# EAGLE design deadlocks3 (EAGLE 8.7.1)
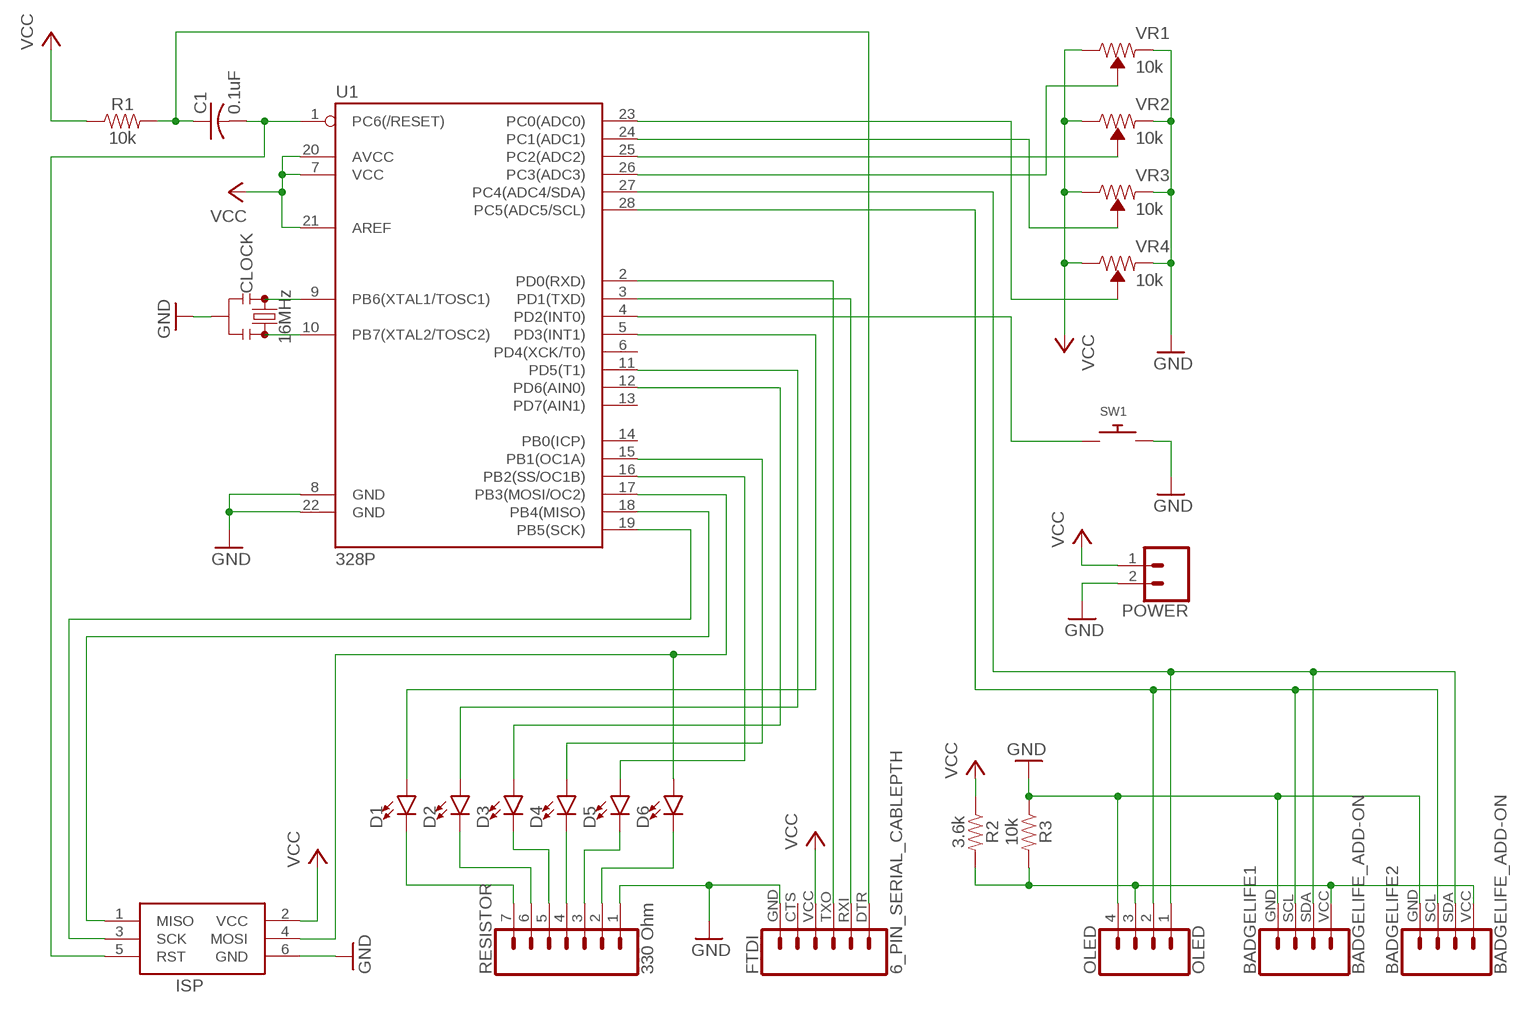
[diagram p0: schematic, sheet 1]

## Parts
BADGELIFE1  BADGELIFE_ADD-ON  [BADGELIFE_ADD-ON]
BADGELIFE2  BADGELIFE_ADD-ON  [BADGELIFE_ADD-ON]
C1  0.1uF  C-US025-024X044  [C025-024X044]
CLOCK  16MHz  RESONATORPTH-7.6X3.8  [RESONATOR-PTH-7.6X3.8]
D1  LED5MM  [LED_5MM]
D2  LED5MM  [LED_5MM]
D3  LED5MM  [LED_5MM]
D4  LED5MM  [LED_5MM]
D5  LED5MM  [LED_5MM]
D6  LED5MM  [LED_5MM]
FTDI  6_PIN_SERIAL_CABLEPTH  [FTDI_BASIC]
ISP  AVRISP-6  [AVRISP]
OLED  OLED  CONN_04  [1X04]
POWER  CONN_02  [1X02]
R1  10k  10KOHM-HORIZ-1/4W-1%  [AXIAL-0.3]
R2  3.6k  10KOHM-HORIZ-1/4W-1%  [AXIAL-0.3]
R3  10k  10KOHM-HORIZ-1/4W-1%  [AXIAL-0.3]
RESISTOR  330 Ohm  CONN_07  [1X07]
SW1  SWITCH_PUSHBUTTONEVQ-PE  [TACT_PANA-EVQ]
U1  328P  ATMEGA328P_PDIP  [DIP28]
VR1  10k  TRIMPOT-PTH-10MM-KNOB-1/2W-10%  [TRIMPOT-PTH-3386U]
VR2  10k  TRIMPOT-PTH-10MM-KNOB-1/2W-10%  [TRIMPOT-PTH-3386U]
VR3  10k  TRIMPOT-PTH-10MM-KNOB-1/2W-10%  [TRIMPOT-PTH-3386U]
VR4  10k  TRIMPOT-PTH-10MM-KNOB-1/2W-10%  [TRIMPOT-PTH-3386U]

## Nets
GND: BADGELIFE1.GND BADGELIFE2.GND CLOCK.2 FTDI.GND ISP.6(GND) OLED.4 POWER.2 R3.P$1 RESISTOR.1 SW1.P$2 U1.8(GND) U1.22(GND) VR1.1(CCW) VR2.1(CCW) VR3.1(CCW) VR4.1(CCW)
N$1: U1.26(PC3(ADC3)) VR1.2(WIPER)
N$2: CLOCK.1 U1.9(PB6(XTAL1/TOSC1))
N$3: CLOCK.3 U1.10(PB7(XTAL2/TOSC2))
N$4: U1.25(PC2(ADC2)) VR2.2(WIPER)
N$5: U1.24(PC1(ADC1)) VR3.2(WIPER)
N$6: U1.23(PC0(ADC0)) VR4.2(WIPER)
N$7: FTDI.RXI U1.3(PD1(TXD))
N$8: FTDI.TXO U1.2(PD0(RXD))
N$9: ISP.1(MISO) U1.18(PB4(MISO))
N$10: BADGELIFE1.VCC BADGELIFE2.VCC OLED.3 R2.P$2 R3.P$2
N$11: C1.2 ISP.5(RST) U1.1(PC6(/RESET))
N$12: D6.K(C) RESISTOR.2
N$13: D5.K(C) RESISTOR.3
N$14: D4.K(C) RESISTOR.4
N$15: D3.K(C) RESISTOR.5
N$16: D2.K(C) RESISTOR.6
N$17: D1.K(C) RESISTOR.7
N$18: D6.A ISP.4(MOSI) U1.17(PB3(MOSI/OC2))
N$19: D1.A U1.5(PD3(INT1))
N$20: D2.A U1.11(PD5(T1))
N$21: D3.A U1.12(PD6(AIN0))
N$22: D4.A U1.15(PB1(OC1A))
N$23: D5.A U1.16(PB2(SS/OC1B))
N$24: ISP.3(SCK) U1.19(PB5(SCK))
N$25: SW1.P$1 U1.4(PD2(INT0))
N$26: BADGELIFE1.SDA BADGELIFE2.SDA OLED.1 U1.27(PC4(ADC4/SDA))
N$27: C1.1 FTDI.DTR R1.P$2
N$28: BADGELIFE1.SCL BADGELIFE2.SCL OLED.2 U1.28(PC5(ADC5/SCL))
VCC: FTDI.VCC ISP.2(VCC) POWER.1 R1.P$1 R2.P$1 U1.7(VCC) U1.20(AVCC) U1.21(AREF) VR1.3(CW) VR2.3(CW) VR3.3(CW) VR4.3(CW)
Unconnected: FTDI.CTS U1.6(PD4(XCK/T0)) U1.13(PD7(AIN1)) U1.14(PB0(ICP))

## Library data of the parts
BADGELIFE1 BADGELIFE2 = Badgelife:BADGELIFE_ADD-ON
C1 = adafruit:C-US: CAPACITOR, American symbol
CLOCK = SparkFun-Clocks:RESONATOR: Resonators (Generic) Ceramic resonators are clock-generating components, often used to control timing in microcontrollers. They usually have 3 pins: two pins for oscillation, and one pin for ground. Compared to crystals, resonators have worse tolerance, but are usually much cheaper. Plus, they have built-in load capacitors! These devices are used on boards like the Arduino Pro 8MHz <https://www.sparkfun.com/products/11114> and Arduino Pro 16MHz <https://www.sparkfun.com/products/11113>.
D1-D6 = SparkFun-LED:LED: LED (Generic) Standard schematic elements and footprints for 5mm, 3mm, 1206, and 0603 sized LEDs. Generic LEDs with no color specified.
FTDI = SparkFun-Connectors:6_PIN_SERIAL_CABLE: 6-pin header connection for use with the "FTDI BASIC" pinout - CABLE SIDE. Also known as "Arduino Serial Program Header". This is used on a design to provide a 6-pin connection point for serial communication usually from a USB cable (D+/D-) to these headers (RX/TX). It also has the remaining pins necessary for programming in the Arduino evironment (DTR, GND, and sometimes VCC). Note, this device has "CABLE" in the name. It is intended to be used on a design that usually lives on the end of your USB cable and prvides the converter chip (FTDI232 or FTDI231x) to commnicate serial RX/TX. The "sister" device, named "TARGET" is inteneded to be used on a design that contains a target micro-controller that you wish to program. You can populate with some of these: Female Headers <https://www.sparkfun.com/products/115> (PRT-00115) For reference (or to suit your programming needs) check out these designs: SparkFun FTDI Basic Breakout - 5V <https://www.sparkfun.com/products/9716> (DEV-09716) SparkFun FTDI Basic Breakout - 3.3V <https://www.sparkfun.com/products/9873> (DEV-09873) SparkFun FTDI SmartBasic <https://www.sparkfun.com/products/12935> (DEV-12935) SparkFun Beefy 3 - FTDI Basic Breakout <https://www.sparkfun.com/products/13746> (DEV-13746)
ISP = adafruit:AVRISP: AVR ISP HEADER Standard 6 pin header for AVR programming
OLED = SparkFun-Connectors:CONN_04: Multi connection point. Often used as Generic Header-pin footprint for 0.1 inch spaced/style header connections On any of the 0.1 inch spaced packages, you can populate with these: Break Away Headers - Straight <https://www.sparkfun.com/products/116> (PRT-00116) Break Away Male Headers - Right Angle <https://www.sparkfun.com/products/553> (PRT-00553) Female Headers <https://www.sparkfun.com/products/115> (PRT-00115) Break Away Headers - Machine Pin <https://www.sparkfun.com/products/117> (PRT-00117) Break Away Female Headers - Swiss Machine Pin <https://www.sparkfun.com/products/743> (PRT-00743) For SCREWTERMINALS and SPRING TERMINALS visit here: Screw Terimnals on SparkFun.com <https://www.sparkfun.com/search/results?term=Screw+Terminals> (5mm/3.5mm/2.54mm spacing) This device is also useful as a general connection point to wire up your design to another part of your project. Our various solder wires solder well into these plated through hole pads. Hook-Up Wire - Assortment (Stranded, 22 AWG) <https://www.sparkfun.com/products/11375> (PRT-11375) Hook-Up Wire - Assortment (Solid Core, 22 AWG) <https://www.sparkfun.com/products/11367> (PRT-11367) View the entire wire category on our website here <https://www.sparkfun.com/categories/141> Special notes: Molex polarized connector foot print use with SKU : PRT-08231 with associated crimp pins and housings. 1MM SMD Version SKU: PRT-10208; PROD_ID: CONN-09696
POWER = SparkFun-Connectors:CONN_02: Multi connection point. Often used as Generic Header-pin footprint for 0.1 inch spaced/style header connections On any of the 0.1 inch spaced packages, you can populate with these: Break Away Headers - Straight <https://www.sparkfun.com/products/116> (PRT-00116) Break Away Male Headers - Right Angle <https://www.sparkfun.com/products/553> (PRT-00553) Female Headers <https://www.sparkfun.com/products/115> (PRT-00115) Break Away Headers - Machine Pin <https://www.sparkfun.com/products/117> (PRT-00117) Break Away Female Headers - Swiss Machine Pin <https://www.sparkfun.com/products/743> (PRT-00743) For SCREWTERMINALS and SPRING TERMINALS visit here: Screw Terimnals on SparkFun.com <https://www.sparkfun.com/search/results?term=Screw+Terminals> (5mm/3.5mm/2.54mm spacing) This device is also useful as a general connection point to wire up your design to another part of your project. Our various solder wires solder well into these plated through hole pads. Hook-Up Wire - Assortment (Stranded, 22 AWG) <https://www.sparkfun.com/products/11375> (PRT-11375) Hook-Up Wire - Assortment (Solid Core, 22 AWG) <https://www.sparkfun.com/products/11367> (PRT-11367) View the entire wire category on our website here <https://www.sparkfun.com/categories/141> Special notes: Molex polarized connector foot print use with: PRT-08233 with associated crimp pins and housings. 2.54_SCREWTERM for use with PRT-10571. 3.5mm Screw Terminal footprints for PRT-08084 5mm Screw Terminal footprints for use with PRT-08432
R1 R3 = SparkFun-Resistors:10KOHM: 10kΩ resistor A resistor is a passive two-terminal electrical component that implements electrical resistance as a circuit element. Resistors act to reduce current flow, and, at the same time, act to lower voltage levels within circuits. - Wikipedia; PROD_ID: RES-12183
R2 = SparkFun-Resistors:10KOHM: 10kΩ resistor A resistor is a passive two-terminal electrical component that implements electrical resistance as a circuit element. Resistors act to reduce current flow, and, at the same time, act to lower voltage levels within circuits. - Wikipedia; PROD_ID: RES-12183; VALUE: 10k
RESISTOR = SparkFun-Connectors:CONN_07: Multi connection point. Often used as Generic Header-pin footprint for 0.1 inch spaced/style header connections On any of the 0.1 inch spaced packages, you can populate with these: Break Away Headers - Straight <https://www.sparkfun.com/products/116> (PRT-00116) Break Away Male Headers - Right Angle <https://www.sparkfun.com/products/553> (PRT-00553) Female Headers <https://www.sparkfun.com/products/115> (PRT-00115) Break Away Headers - Machine Pin <https://www.sparkfun.com/products/117> (PRT-00117) Break Away Female Headers - Swiss Machine Pin <https://www.sparkfun.com/products/743> (PRT-00743) For SCREWTERMINALS and SPRING TERMINALS visit here: Screw Terimnals on SparkFun.com <https://www.sparkfun.com/search/results?term=Screw+Terminals> (5mm/3.5mm/2.54mm spacing) This device is also useful as a general connection point to wire up your design to another part of your project. Our various solder wires solder well into these plated through hole pads. Hook-Up Wire - Assortment (Stranded, 22 AWG) <https://www.sparkfun.com/products/11375> (PRT-11375) Hook-Up Wire - Assortment (Solid Core, 22 AWG) <https://www.sparkfun.com/products/11367> (PRT-11367) View the entire wire category on our website here <https://www.sparkfun.com/categories/141> Special notes: Molex polarized connector foot print use with SKU : PRT-08231 with associated crimp pins and housings. 1MM SMD Version SKU: PRT-10208 NOTES ON THE VARIANTS LOCK and LOCK_LONGPADS... This footprint was designed to help hold the alignment of a through-hole component (i.e. 6-pin header) while soldering it into place. You may notice that each hole has been shifted either up or down by 0.005 of an inch from it's more standard position (which is a perfectly straight line). This slight alteration caused the pins (the squares in the middle) to touch the edges of the holes. Because they are alternating, it causes a "brace" to hold the component in place. 0.005 has proven to be the perfect amount of "off-center" position when using our standard breakaway headers. Although looks a little odd when you look at the bare footprint, once you have a header in there, the alteration is very hard to notice. Also,if you push a header all the way into place, it is covered up entirely on the bottom side.
SW1 = adafruit:SWITCH_PUSHBUTTON: Buttons SOFTTOUCHSMD_SJ - Soft touch temporary push button (Super Junk Akihabara) Compatible with SKPMANE010 [Mouser: 688-SKPMAN] C&K_KSS = Digikey: KSS221GLFS
U1 = SparkFun-IC-Microcontroller:ATMEGA328P_PDIP: Atmel 328P Through hole ATMEGA328P uC used in the Arduino 32kb flash, 1k EEPROM, 2k SRAM Datasheet <http://www.sparkfun.com/datasheets/Components/SMD/ATMega328.pdf> SparkFun Products Storefront component: AVR 28 Pin 20MHz 32K 6A/D - ATMega328P <https://www.sparkfun.com/products/9061> (COM-09061) SparkFun Simon Says - Through-Hole Soldering Kit <https://www.sparkfun.com/products/10547> (KIT-10547) SparkFun Learn to Solder - Simon Says <https://www.sparkfun.com/products/13708> (KIT-13708) SparkFun BigTime Watch Kit <https://www.sparkfun.com/products/11734> (KIT-11734) SparkFun ClockIt <https://www.sparkfun.com/products/10930> (KIT-10930) SparkFun Serial Enabled LCD Kit <https://www.sparkfun.com/products/10097> (LCD-10097) SparkFun Simon Tilts - Through Hole Soldering Kit <https://www.sparkfun.com/products/12634> (KIT-12634) SparkFun Frequency Counter Kit <https://www.sparkfun.com/products/10140> (KIT-10140) FabFM Radio Kit <https://www.sparkfun.com/products/11043> (KIT-11043) SparkFun Binary Blaster Kit <https://www.sparkfun.com/products/12037> (KIT-12037) SparkFun Metro-Gnome <https://www.sparkfun.com/products/9236> (KIT-09236) ATmega328 with Arduino Optiboot (Uno) <https://www.sparkfun.com/products/10524> (DEV-10524); PROD_ID: IC-09136
VR1-VR4 = SparkFun-Resistors:TRIMPOT: Trimming Potentiometer (Trimpot) Three-terminal potentiometers, with an adjustable wiper and two adjustable resistors. A pot can be used to create a configurable voltage divider, or as a variable resistor. "Trimpots" are a subset of potentiometers, usually intended for "set-and-forget" applications. They're often more delicate than standard potentiometers - rated for fewer turns. Variants PTH-KNOB - PTH Trimpot w/ finger-adjustable knob Trimpot 10K with Knob <https://www.sparkfun.com/products/9806> (COM-09806) Datasheet <http://www.sparkfun.com/datasheets/Components/General/TSR-3386.pdf> SMD-3MM-CLOSED-FRAME - SMD 3mm Square Closed-Frame Trimpot Used on e.g. EasyDriver - Stepper Motor Driver <https://www.sparkfun.com/products/12779> Datasheet <http://www.bitechnologies.com/pdfs/22.pdf> (22AR10KTR) SMD-5MM - SMD 5mm Square Closed-Frame Trimpot Used on e.g. IOIO-OTG - V2.2 <https://www.sparkfun.com/products/13613> Datasheet <http://www.vishay.com/docs/51008/ts53.pdf> (TS53YL502MR10) SMD-3MM-1/10W-25% - 3mm Square Open-Frame Trimpot Used on e.g. SparkFun Shapeoko <https://www.sparkfun.com/products/13899> Datasheet <http://www.bourns.com/docs/Product-Datasheets/TC33.pdf> (TC33X-2-103E); PROD_ID: RES-09730; SF_SKU: COM-09806

## Net classes
0 default: width 0.127 mm, clearance 0.254 mm

## Board
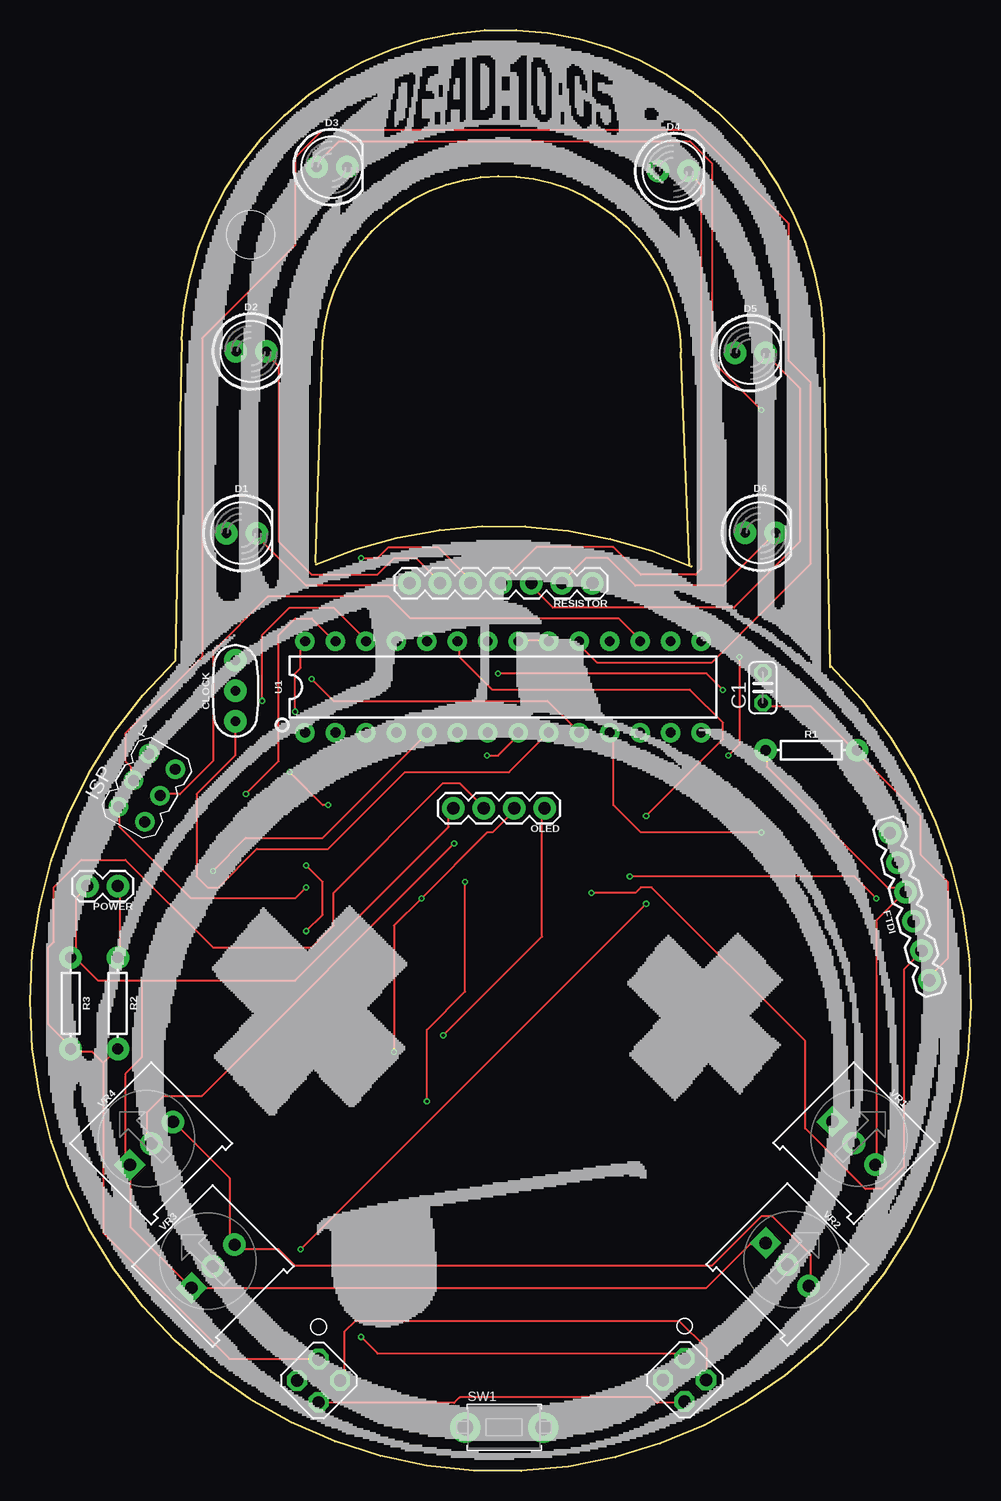
[diagram p1: board, top side]
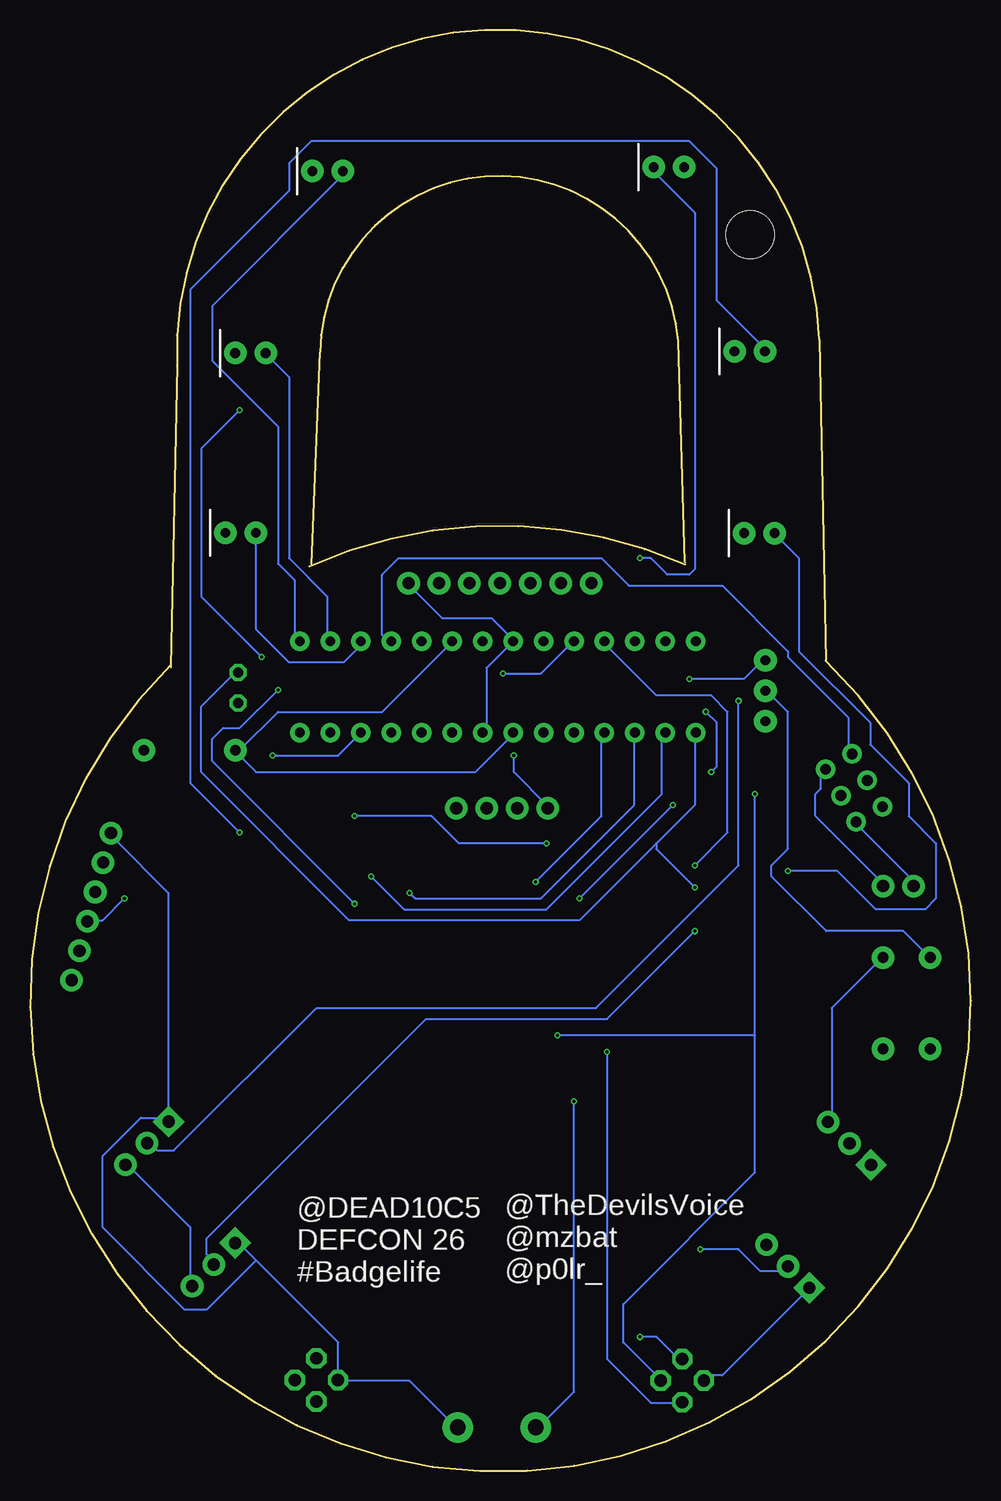
[diagram p2: board, bottom side, seen from below]

Size 78.45 x 120.12 mm. Coordinates in mm from the lower left corner, seen from the top.
Outline: 23.83,75.58 arc-47 55.16,75.41
Outline: 23.83,75.76 24.36,92.73 arc-180 54.28,93.26 54.98,75.58
Outline: 66.18,92.03 arc181 12.63,94.31 12.11,67.53 arc272 66.71,67.18
Outline: 66.18,92.21 66.71,67.01
Copper layers (1*16): Top 0.035559375mm / dielectric 1.6mm / Bottom 0.035559375mm
Design rules "oshpark-2layer": minimum track width 6mil, minimum drill 10mil, track to track 6mil, track to pad 6mil, pad to pad 6mil, via to via 6mil, smd to smd 6mil, copper to edge 15mil, drill to drill 6mil, minimum pad ring 5mil, minimum via ring 5mil, stop-mask expansion 2.5mil, vias tented up to drill 0mil, thermal gap 10mil
Holes 4 mm at 18.41,103.06

### Footprints (pad centres in the part's own frame; a part is rotated, then mirrored left to right if it is on the bottom)
BADGELIFE_ADD-ON = drill 1.016 pad 1.676 octagon: GND 1.27,-1.27; SCL 1.27,1.27; SDA -1.27,1.27; VCC -1.27,-1.27
C025-024X044 = drill 0.813 pad 1.422 octagon: 1 -1.27,0; 2 1.27,0
RESONATOR-PTH-7.6X3.8 = drill 0.8 pad 1.88: 1 -2.54,0; 2 0,0; 3 2.54,0
LED_5MM = drill 0.813 pad 1.88: A -1.27,0; K 1.27,0
FTDI_BASIC = drill 1.016 pad 1.88: CTS 10.16,0; DTR 0,0; GND 12.7,0; RXI 2.54,0; TXO 5.08,0; VCC 7.62,0
AVRISP = drill 0.9 pad 1.626: 1 -1.27,2.54; 2 1.27,2.54; 3 -1.27,0; 4 1.27,0; 5 -1.27,-2.54; 6 1.27,-2.54
1X04 = drill 1.016 pad 1.88: 1 0,0; 2 2.54,0; 3 5.08,0; 4 7.62,0
1X02 = drill 1.016 pad 1.88: 1 0,0; 2 2.54,0
AXIAL-0.3 = drill 0.9 pad 1.88: P$1 -3.81,0; P$2 3.81,0
1X07 = drill 1.016 pad 1.88: 1 0,0; 2 2.54,0; 3 5.08,0; 4 7.62,0; 5 10.16,0; 6 12.7,0; 7 15.24,0
TACT_PANA-EVQ = drill 1.3 pad 2.54: P$1 -3.25,0; P$2 3.25,0
DIP28 = drill 0.813 pad 1.626: 1 -16.51,-3.81; 2 -13.97,-3.81; 3 -11.43,-3.81; 4 -8.89,-3.81; 5 -6.35,-3.81; 6 -3.81,-3.81; 7 -1.27,-3.81; 8 1.27,-3.81; 9 3.81,-3.81; 10 6.35,-3.81; 11 8.89,-3.81; 12 11.43,-3.81; 13 13.97,-3.81; 14 16.51,-3.81; 15 16.51,3.81; 16 13.97,3.81; 17 11.43,3.81; 18 8.89,3.81; 19 6.35,3.81; 20 3.81,3.81; 21 1.27,3.81; 22 -1.27,3.81; 23 -3.81,3.81; 24 -6.35,3.81; 25 -8.89,3.81; 26 -11.43,3.81; 27 -13.97,3.81; 28 -16.51,3.81
TRIMPOT-PTH-3386U = drill 1.016 pad 1.88 square: 1 -2.54,-0.015 | drill 1.016 pad 1.88: 2 0,-0.015; 3 2.54,-0.015

### Placement (x,y rotation side)
BADGELIFE1  54.58,7.59 225 top
BADGELIFE2  24.07,7.54 225 top
C1  61.1,65.3 90 top
CLOCK  17.14,65.03 90 top
D1  17.64,78.18 0 top
D2  18.45,93.33 0 top
D3  25.17,108.69 0 top
D4  53.65,108.36 0 top
D5  60.07,93.2 0 top
D6  60.9,78.21 0 top
FTDI  74.98,40.91 105 top
ISP  9.74,56.94 330 top
OLED  42.91,55.25 180 top
POWER  7.32,48.76 180 top
R1  65.14,60.09 0 top
R2  7.32,39 270 top
R3  3.39,39 270 top
RESISTOR  46.89,74.01 180 top
SW1  39.53,3.64 0 top
U1  39.45,65.36 0 top
VR1  68.7,27.34 315 top
VR2  63.14,17.22 315 top
VR3  15.25,17.07 45 top
VR4  10.11,27.32 45 top

### Tracks (layer width: path | path; a pad name or v marks a point on that pad's centre or on a via)
GND  (via drill 0.25)
  Top 0.152: POWER.2 4.74,48.66 3.83,47.74 3.83,43.17 R3.P$1 3.83,42.72 5.65,40.89 9.31,40.89 | 9.31,40.89 22.11,40.89 34.92,53.69 34.92,55.06 OLED.4 | v38.12,59.63 39.03,59.63 40.4,61 40.4,61.46 U1.8 | 9.31,40.89 9.31,34.49 7.94,33.11 7.94,25.8 VR4.1 8.4,25.34 8.4,20.31 13.43,15.28 VR3.1 13.88,15.28 56.4,15.28 60.06,18.94 60.98,18.94 VR2.1
  Bottom 0.152: 66.92,29.46 66.92,48.2 71.49,52.77 FTDI.GND | SW1.P$2 43.14,3.85 46.8,7.51 52.75,7.51 BADGELIFE1.GND 52.75,7.97 52.75,10.71 59.6,17.57 | 59.6,17.57 60.98,18.94 VR2.1 | 66.92,29.46 69.21,29.46 72.41,26.26 72.41,20.31 65.55,13.45 63.72,13.45 59.6,17.57 | 66.92,29.46 VR1.1 | BADGELIFE2.GND 22.11,7.97 20.74,7.97 13.88,14.83 VR3.1 | U1.8 40.4,61.92 40.4,66.95 38.57,68.78 U1.22 38.12,69.23 39.94,71.06 44.06,71.06 46.8,73.81 RESISTOR.1 | ISP.6 9.31,53.69 4.74,49.12 POWER.2 | CLOCK.2 17.08,64.66 16.63,64.66 15.26,63.29 15.26,51.86 16.63,50.49 16.63,49.57 12.06,45 5.65,45 3.83,43.17 R3.P$1 | v38.12,59.63 38.12,58.26 35.37,55.52 OLED.4
N$1  (via drill 0.25)
  Top 0.152: v19.37,64.2 19.37,69.69 21.66,71.98 25.31,71.98 27.6,69.69 27.6,69.23 U1.26
  Bottom 0.152: v19.37,64.2 19.37,50.49 31.26,38.6 54.57,38.6 66.46,26.71 67.83,26.71 68.29,27.17 VR1.2
N$2
  Top 0.152: U1.9 43.14,61.46 39.94,58.26 31.26,58.26 24.86,51.86 18.91,51.86 15.71,48.66 14.8,48.66 13.88,49.57 13.88,56.43 17.08,59.63 17.08,62.38 CLOCK.1
N$3  (via drill 0.25)
  Top 0.152: v23.49,66.03 25.31,64.2 43.14,64.2 45.43,61.92 U1.10
  Bottom 0.152: v23.49,66.03 18.91,66.03 17.54,67.4 CLOCK.3
N$4  (via drill 0.25)
  Top 0.152: v23.03,50.49 24.4,49.12 24.4,46.37 v23.03,45
  Bottom 0.152: v23.03,50.49 20.28,53.23 20.28,63.29 21.66,64.66 26.23,64.66 30.34,68.78 U1.25 | v23.03,45 30.34,37.69 45.43,37.69 63.72,19.4 63.72,18.03 63.26,17.57 VR2.2
N$5  (via drill 0.25)
  Top 0.152: v39.03,66.49 56.4,66.49 v57.78,65.12 | v22.57,18.48 v51.37,47.29
  Bottom 0.152: v39.03,66.49 35.83,66.49 33.54,68.78 U1.24 | v57.78,65.12 60.98,61.92 62.35,61.92 63.26,61 63.26,59.17 v51.37,47.29 | v22.57,18.48 19.37,18.48 17.54,16.66 15.71,16.66 VR3.2
N$6  (via drill 0.25)
  Top 0.152: v51.37,54.6 57.78,61 57.78,62.38 55.03,65.12 38.57,65.12 35.83,67.86 35.83,68.78 U1.23 | v35.37,52.32 14.34,31.29 11.14,31.29 9.77,29.91 9.77,27.63 VR4.2
  Bottom 0.152: v51.37,54.6 44.97,54.6 42.69,52.32 v35.37,52.32
N$7  (via drill 0.25)
  Top 0.152: v46.8,48.2 50.46,48.2 50.92,48.66 51.83,48.66 64.63,35.86 64.63,28.54 69.66,23.51 71.03,23.51 72.86,25.34 72.86,41.8 74.23,43.17 FTDI.RXI
  Bottom 0.152: v46.8,48.2 46.35,47.74 35.83,47.74 28.06,55.52 28.06,61.46 U1.3
N$8  (via drill 0.25)
  Top 0.152: v50,49.57 68.75,49.57 v70.58,47.74
  Bottom 0.152: v50,49.57 47.26,46.83 35.37,46.83 25.77,56.43 25.77,61.46 U1.2 | v70.58,47.74 72.41,45.92 73.32,45.92 FTDI.TXO
N$9
  Bottom 0.152: ISP.1 10.23,60.09 10.23,62.83 15.26,67.86 15.26,68.32 20.74,73.81 28.51,73.81 30.8,76.09 47.72,76.09 49.09,74.72 49.09,69.69 48.63,69.23 U1.18
N$10  (via drill 0.25)
  Top 0.152: 6.11,34.03 6.11,19.86 16.63,9.34 23.94,9.34 BADGELIFE2.VCC | 6.11,34.03 7.03,34.94 R2.P$2 | v27.6,11.17 28.97,9.8 54.57,9.8 BADGELIFE1.VCC | 6.11,34.03 5.2,34.94 3.83,34.94 R3.P$2 3.37,35.4 1.54,37.23 1.54,43.63 2,44.09 2,48.66 4.28,50.95 7.94,50.95 15.26,43.63 23.49,43.63 25.31,45.46 25.31,48.2 34.46,57.35 35.83,57.35 37.66,55.52 OLED.3
  Bottom 0.152: v27.6,11.17 26.23,11.17 24.4,9.34 BADGELIFE2.VCC
N$11  (via drill 0.25)
  Top 0.152: v23.03,48.66 22.11,47.74 13.43,47.74 7.48,53.69 7.48,55.06 ISP.5
  Bottom 0.152: 26.23,52.32 23.03,55.52 23.03,61.46 U1.1 | 26.23,52.32 32.63,45.92 51.83,45.92 64.18,58.26 64.18,63.75 61.43,66.49 C1.2 | v23.03,48.66 26.23,51.86 26.23,52.32
N$12
  Top 0.152: RESISTOR.2 44.52,74.26 46.35,76.09 48.17,76.09 50.46,73.81 57.78,73.81 61.89,77.92 D6.K
N$13
  Top 0.152: RESISTOR.3 42.23,73.81 42.23,73.35 43.6,71.98 58.69,71.98 64.18,77.46 64.18,90.26 61.43,93.01 D5.K
N$14
  Top 0.152: RESISTOR.4 39.49,74.26 42.23,77.01 48.63,77.01 50.92,74.72 55.49,74.72 55.95,75.18 55.95,107.18 55.03,108.1 D4.K
N$15  (via drill 0.25)
  Top 0.152: v27.6,76.09 28.97,76.09 29.89,77.01 34,77.01 36.29,74.72 36.29,74.26 RESISTOR.5
  Bottom 0.152: v27.6,76.09 26.69,76.09 25.31,74.72 23.49,74.72 23.03,75.18 23.03,104.89 26.69,108.55 D3.K
N$16
  Top 0.152: RESISTOR.6 34,74.26 32.17,76.09 30.34,76.09 28.97,74.72 23.49,74.72 20.74,77.46 20.74,92.09 19.83,93.01 D2.K
N$17
  Top 0.152: D1.K 18.91,77.92 23.03,73.81 31.26,73.81 RESISTOR.7
N$18
  Top 0.152: ISP.4 11.14,56.43 12.51,56.43 15.26,59.17 15.26,68.32 19.83,72.89 29.89,72.89 31.71,71.06 49.09,71.06 50.92,69.23 U1.17
  Bottom 0.152: D6.A 59.6,77.92 59.6,70.15 56.86,67.4 52.29,67.4 50.92,68.78 U1.17
N$19  (via drill 0.25)
  Top 0.152: v15.26,50.03 18,52.77 24.4,52.77 33.09,61.46 U1.5
  Bottom 0.152: v15.26,50.03 11.14,50.03 7.94,46.83 3.83,46.83 2.91,47.74 2.91,52.32 5.2,54.6 5.2,57.35 8.4,60.55 8.4,62.38 14.34,68.32 14.34,76.09 16.17,77.92 D1.A
N$20  (via drill 0.25)
  Top 0.152: v60.98,53.23 50.92,53.23 48.63,55.52 48.63,61.46 U1.11
  Bottom 0.152: v60.98,53.23 65.09,57.35 65.09,98.49 56.86,106.72 56.86,109.01 55.03,110.84 23.49,110.84 21.2,108.55 21.2,97.58 17.08,93.46 D2.A
N$21  (via drill 0.25)
  Top 0.152: v58.23,59.63 59.15,60.55 v59.15,67.86 | v60.98,88.44 56.86,92.55 56.86,109.01 55.03,110.84 25.77,110.84 23.94,109.01 D3.A
  Bottom 0.152: v58.23,59.63 52.75,59.63 50.92,61.46 U1.12 | v59.15,67.86 64.18,72.89 64.18,85.24 v60.98,88.44
N$22
  Bottom 0.152: U1.15 56.4,69.23 56.4,74.26 57.78,75.63 57.78,87.06 63.26,92.55 63.26,97.12 52.29,108.1 D4.A
N$23
  Bottom 0.152: U1.16 53.66,69.23 53.66,72.89 56.86,76.09 56.86,91.18 58.69,93.01 D5.A
N$24
  Top 0.152: ISP.3 8.4,57.8 8.4,58.72 7.94,59.17 7.94,61.46 14.34,67.86 14.34,94.42 22.11,102.19 22.11,109.47 24.4,111.75 55.49,111.75 63.26,103.98 63.26,92.55 65.09,90.72 65.09,75.63 56.86,67.4 47.26,67.4 45.89,68.78 U1.19
N$25  (via drill 0.25)
  Top 0.152: v36.29,49.12 36.29,39.97 33.09,36.77 v33.09,30.83
  Bottom 0.152: v36.29,49.12 30.8,54.6 30.8,61.46 U1.4 | v33.09,30.83 33.09,6.6 35.83,3.85 SW1.P$1
N$26  (via drill 0.25)
  Top 0.152: v18,56.43 20.74,59.17 20.74,69.69 22.11,71.06 23.49,71.06 25.31,69.23 U1.27 | BADGELIFE1.SDA 56.4,7.97 56.4,10.25 54.12,12.54 27.14,12.54 26.23,11.63 26.23,7.97 BADGELIFE2.SDA | v34.46,36.31 42.69,44.54 42.69,55.06 OLED.1
  Bottom 0.152: 18,36.31 18,24.88 28.97,13.91 28.97,10.71 26.23,7.97 BADGELIFE2.SDA | 18,36.31 v18,56.43 | 18,36.31 v34.46,36.31
N$27
  Top 0.152: C1.1 61.43,63.75 65.09,63.75 68.75,60.09 R1.P$2 69.21,59.63 74.23,54.6 74.23,51.4 76.52,49.12 76.52,42.72 75.15,41.34 FTDI.DTR
N$28  (via drill 0.25)
  Top 0.152: BADGELIFE2.SCL 24.4,5.68 35.37,5.68 35.83,6.14 51.83,6.14 52.29,5.68 54.57,5.68 BADGELIFE1.SCL | v22.11,63.29 22.11,66.49 22.57,66.95 22.57,68.78 U1.28 | v21.66,58.26 24.4,55.52 v24.86,55.52 | OLED.2 40.4,55.06 38.57,53.23 38.12,53.23 v32.63,47.74 30.34,45.46 v30.34,34.94
  Bottom 0.152: v22.11,63.29 21.2,62.38 21.2,58.72 v21.66,58.26 | v32.63,47.74 v24.86,55.52 | v30.34,34.94 30.34,9.34 26.69,5.68 24.4,5.68 BADGELIFE2.SCL
VCC
  Top 0.152: VR4.3 12.06,29 16.63,24.43 16.63,18.94 VR3.3 17.08,18.48 20.74,18.48 22.11,17.11 56.86,17.11 60.98,21.23 61.89,21.23 65.09,18.03 65.09,15.74 VR2.3 | R2.P$1 7.48,43.17 7.48,48.66 POWER.1 | U1.21 40.86,69.23 43.14,69.23 U1.20 | R1.P$1 61.43,59.63 61.43,58.72 71.49,48.66 72.86,48.66 FTDI.VCC 72.86,48.2 70.58,45.92 70.58,25.8 VR1.3
  Bottom 0.152: ISP.2 12.51,58.26 12.51,56.89 12.97,56.43 12.97,54.6 7.48,49.12 POWER.1 | VR4.3 11.6,29.46 11.6,38.6 7.48,42.72 R2.P$1 | VR2.3 65.09,15.74 65.09,20.31 70.12,25.34 VR1.3 | U1.7 38.57,61.46 38.57,61 41.32,58.26 59.6,58.26 60.98,59.63 R1.P$1 60.98,60.09 57.78,63.29 49.09,63.29 43.6,68.78 U1.20

### Text on the board
bPlace: @TheDevilsVoice / @mzbat / @p0lr_ | @DEAD10C5 / DEFCON 26 / #Badgelife